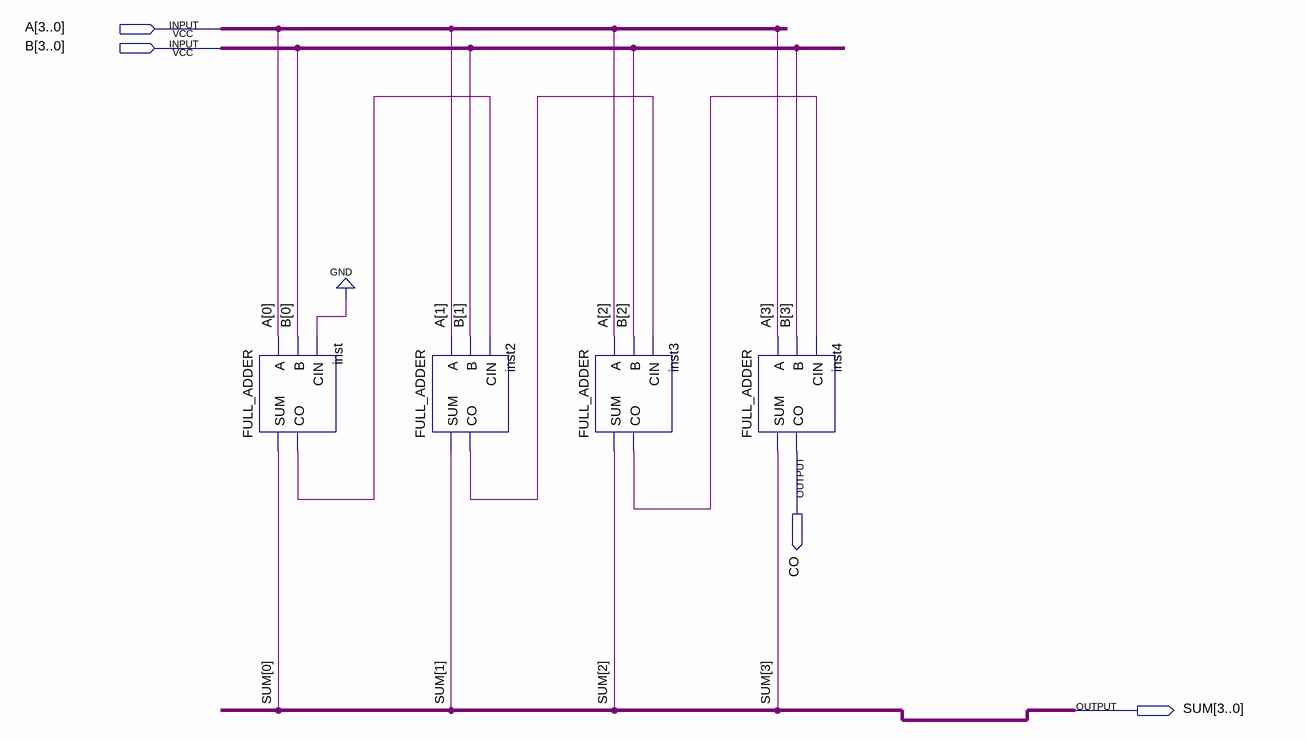
[diagram p0: schematic sheet]
// Quartus schematic FULL_ADDER_4bit.bdf as structural Verilog: 4 symbols, 4 pins
module FULL_ADDER_4bit (
  input  [3:0] A,
  input  [3:0] B,
  output CO,
  output [3:0] SUM
);

  wire inst2_co, inst3_co, inst_co;

  FULL_ADDER inst (.A(A[0]), .B(B[0]), .CIN(1'b0), .SUM(SUM[0]), .CO(inst_co));
  FULL_ADDER inst2 (.A(A[1]), .B(B[1]), .CIN(inst_co), .SUM(SUM[1]), .CO(inst2_co));
  FULL_ADDER inst3 (.A(A[2]), .B(B[2]), .CIN(inst2_co), .SUM(SUM[2]), .CO(inst3_co));
  FULL_ADDER inst4 (.A(A[3]), .B(B[3]), .CIN(inst3_co), .SUM(SUM[3]), .CO(CO));
endmodule
